# EAGLE schematic Battery Charger (EAGLE 9.6.2)

## Sheet 1 of 5
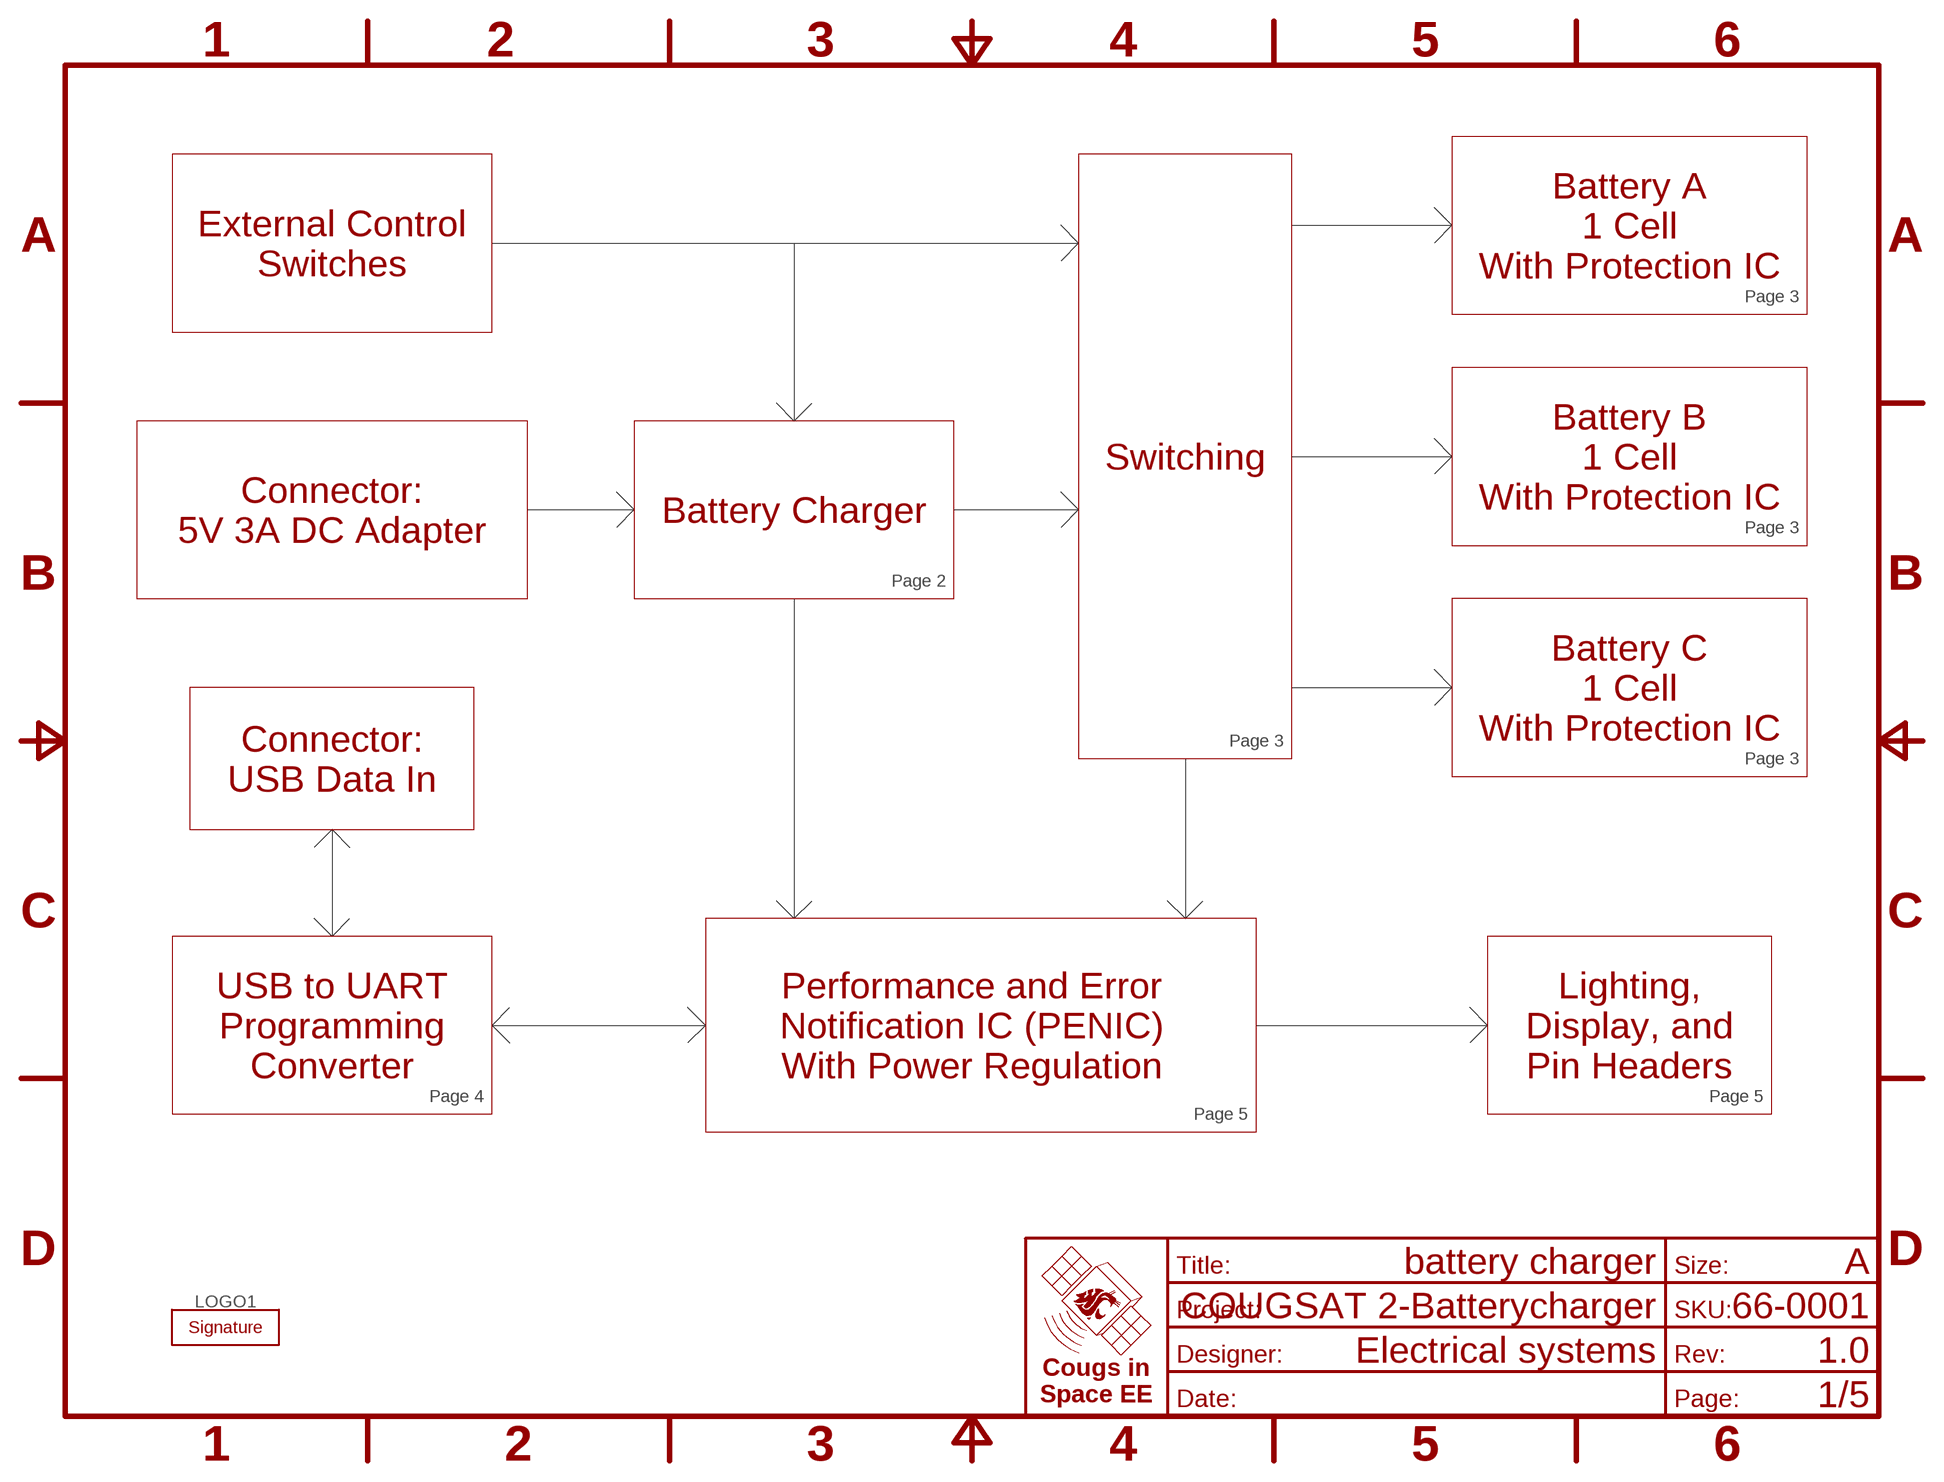
[diagram p0: schematic, sheet 1]
FRAME1 (FRAME-A): DESIGNER: Electrical systems; PART_NUMBER: 66-0001; PROJECT: COUGSAT 2-Batterycharger; REV: 1.0; TITLE: battery charger

### Parts
LOGO1  SIGNATUREZACHARY  [SIGN-ZACHARY]

### Notes on the sheet
- Battery A
  1 Cell
  With Protection IC
- External Control
  Switches
- Page 3
- Switching
- Battery B
  1 Cell
  With Protection IC
- Connector:
  5V 3A DC Adapter
- Battery Charger
- Page 3
- Page 2
- Battery C
  1 Cell
  With Protection IC
- Page 3
- Connector:
  USB Data In
- Page 3
- USB to UART
  Programming
  Converter
- Performance and Error
  Notification IC (PENIC)
  With Power Regulation
- Lighting,
  Display, and
  Pin Headers
- Page 4 | Page 5
- Page 5

## Sheet 2 of 5
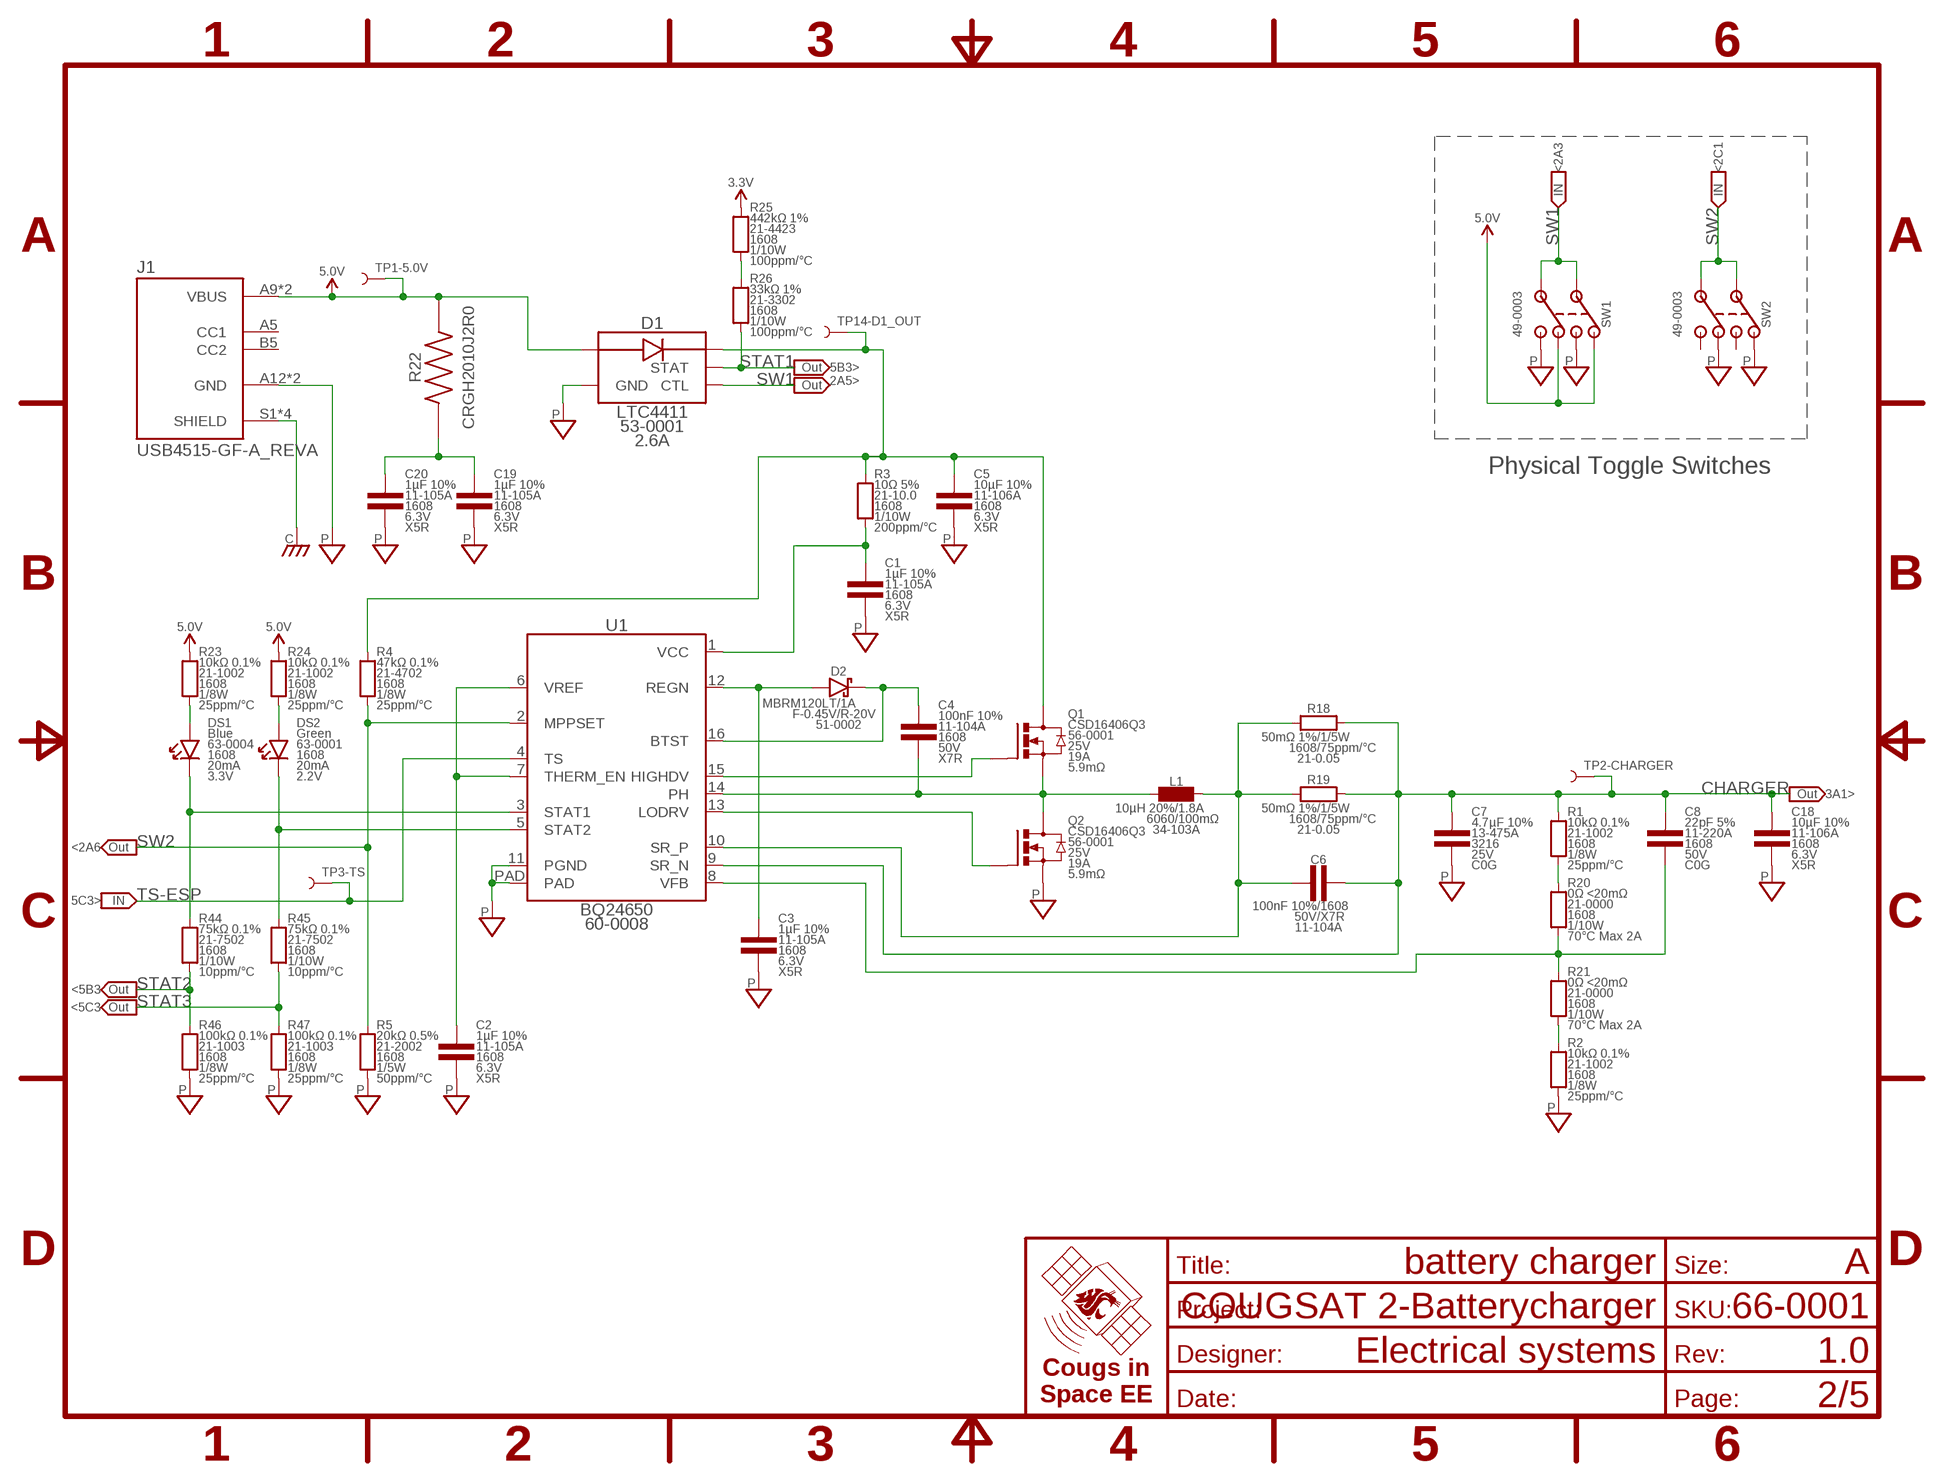
[diagram p1: schematic, sheet 2]
FRAME2 (FRAME-A): DESIGNER: Electrical systems; PART_NUMBER: 66-0001; PROJECT: COUGSAT 2-Batterycharger; REV: 1.0; TITLE: battery charger

### Parts
C1  1µF 10%  CAP-V-1UF-1608  [1608]
C2  1µF 10%  CAP-V-1UF-1608  [1608]
C3  1µF 10%  CAP-V-1UF-1608  [1608]
C4  100nF 10%  CAP-V-100NF-1608  [1608]
C5  10µF 10%  CAP-V-10UF-1608  [1608]
C6  100nF 10%  CAP-H-100NF-1608  [1608]
C7  4.7µF 10%  CAP-V-4.7UF-3216  [3216]
C8  22pF 5%  CAP-V-22PF-1608  [1608]
C18  10µF 10%  CAP-V-10UF-1608  [1608]
C19  1µF 10%  CAP-V-1UF-1608  [1608]
C20  1µF 10%  CAP-V-1UF-1608  [1608]
D1  LTC4411  [SOT23-5]
D2  MBRM120LT  DIODE-SCHOTTKY-H-POWERMITE  [POWERMITE]
DS1  Blue  LED-V-BLU-1608  [1608-POL]
DS2  Green  LED-V-GRN-1608  [1608-POL]
J1  USB4515-GF-A_REVA  [GCT_USB4515-GF-A_REVA]
L1  10µH 20%  INDUCTOR-H-10UH-6060  [6060]
Q1  CSD16406Q3  MOSFET-N-SON-3333  [SON-3333]
Q2  CSD16406Q3  MOSFET-N-SON-3333  [SON-3333]
R1  10kΩ 0.1%  RES-V-10K-1608  [1608]
R2  10kΩ 0.1%  RES-V-10K-1608  [1608]
R3  10Ω 5%  RES-V-10R-1608  [1608]
R4  47kΩ 0.1%  RES-V-47K-1608  [1608]
R5  20kΩ 0.5%  RES-V-20K-1608  [1608]
R18  50mΩ 1%  RES-H-0.05R-1608  [1608]
R19  50mΩ 1%  RES-H-0.05R-1608  [1608]
R20  0Ω <20mΩ  RES-V-0-1608  [1608]
R21  0Ω <20mΩ  RES-V-0-1608  [1608]
R22  CRGH2010J2R0  [RESC5025X65N]
R23  10kΩ 0.1%  RES-V-10K-1608  [1608]
R24  10kΩ 0.1%  RES-V-10K-1608  [1608]
R25  442kΩ 1%  RES-V-442K-1608  [1608]
R26  33kΩ 1%  RES-V-33K-1608  [1608]
R44  75kΩ 0.1%  RES-V-75K-1608  [1608]
R45  75kΩ 0.1%  RES-V-75K-1608  [1608]
R46  100kΩ 0.1%  RES-V-100K-1608  [1608]
R47  100kΩ 0.1%  RES-V-100K-1608  [1608]
SW1  SWITCH-DPDT-100DP1T1B1M2QE  [100DP1T1B1M2QE]
SW2  SWITCH-DPDT-100DP1T1B1M2QE  [100DP1T1B1M2QE]
TP1-5.0V  TEST_POINT-SMD-C-1.25  [SMD-C-1.25]
TP2-CHARGER  TEST_POINT-SMD-C-1.25  [SMD-C-1.25]
TP3-TS  TEST_POINT-SMD-C-1.25  [SMD-C-1.25]
TP14-D1_OUT  TEST_POINT-SMD-C-1.25  [SMD-C-1.25]
U1  BQ24650  [QFN-16-3535]

### Nets
3.3V: R25.2 ; also sheet 3,5
5.0V: D1.1(IN) J1.A9(VBUS) J1.B9(VBUS) R22.2 R23.2 R24.2 SW1.1-A SW1.1-B TP1-5.0V.1 ; also sheet 3,5
BQ24650_BTST: C4.1 D2.C U1.16(BTST)
BQ24650_HIGHDV: Q1.4(G) U1.15(HIGHDV)
BQ24650_LODRV: Q2.4(G) U1.13(LODRV)
BQ24650_PH: C4.2 L1.1 Q1.1(S) Q1.2(S) Q1.3(S) Q2.5(D) Q2.6(D) Q2.7(D) Q2.8(D) Q2.PAD(D) U1.14(PH)
BQ24650_REGN: C3.1 D2.A U1.12(REGN)
BQ24650_SR_P: C6.1 L1.2 R18.1 R19.1 U1.10(SR_P)
BQ24650_STAT1: DS1.C R44.2 U1.3(STAT1)
BQ24650_STAT2: DS2.C R45.2 U1.5(STAT2)
BQ24650_VCC: C1.1 R3.1 U1.1(VCC)
BQ24650_VFB: C8.2 R20.1 R21.2 U1.8(VFB)
BQ24650_VREF: C2.1 U1.6(VREF) U1.7(THERM_EN)
CHARGER: C6.2 C7.1 C8.1 C18.1 R1.2 R18.2 R19.2 TP2-CHARGER.1 U1.9(SR_N) ; also sheet 3
CHASSIS: J1.S1(SHIELD) J1.S2(SHIELD) J1.S3(SHIELD) J1.S4(SHIELD) ; also sheet 4
D1_OUT: C5.1 D1.5(OUT) Q1.5(D) Q1.6(D) Q1.7(D) Q1.8(D) Q1.PAD(D) R3.2 R4.2 TP14-D1_OUT.1
N$11: DS1.A R23.1
N$15: R1.1 R20.2
N$32: R2.2 R21.1
N$33: DS2.A R24.1
N$34: C19.1 C20.1 R22.1
N$35: R25.1 R26.2
PGND: C1.2 C2.2 C3.2 C5.2 C7.2 C18.2 C19.2 C20.2 D1.2(GND) J1.A12(GND) J1.B12(GND) Q2.1(S) Q2.2(S) Q2.3(S) R2.1 R5.1 R46.1 R47.1 SW1.2-A SW1.2-B SW2.1-A SW2.1-B U1.11(PGND) U1.PAD ; also sheet 3,4,5
STAT1: D1.4(STAT) R26.1 ; also sheet 5
STAT2: R44.1 R46.2 ; also sheet 5
STAT3: R45.1 R47.2 ; also sheet 5
SW1: D1.3(CTL) SW1.COM-A SW1.COM-B
SW2: R4.1 R5.2 SW2.COM-A SW2.COM-B U1.2(MPPSET)
TS-ESP: TP3-TS.1 U1.4(TS) ; also sheet 5
Unconnected: J1.A5(CC1) J1.B5(CC2) SW2.2-A SW2.2-B

### Notes on the sheet
- <2A3 | <2C1
- SW1 | SW2
- STAT1 | 5B3>
- SW1 | 2A5>
- Physical Toggle Switches
- 3A1>
- <2A6 | SW2
- 5C3>
- <5B3 | STAT2
- <5C3 | STAT3

## Sheet 3 of 5
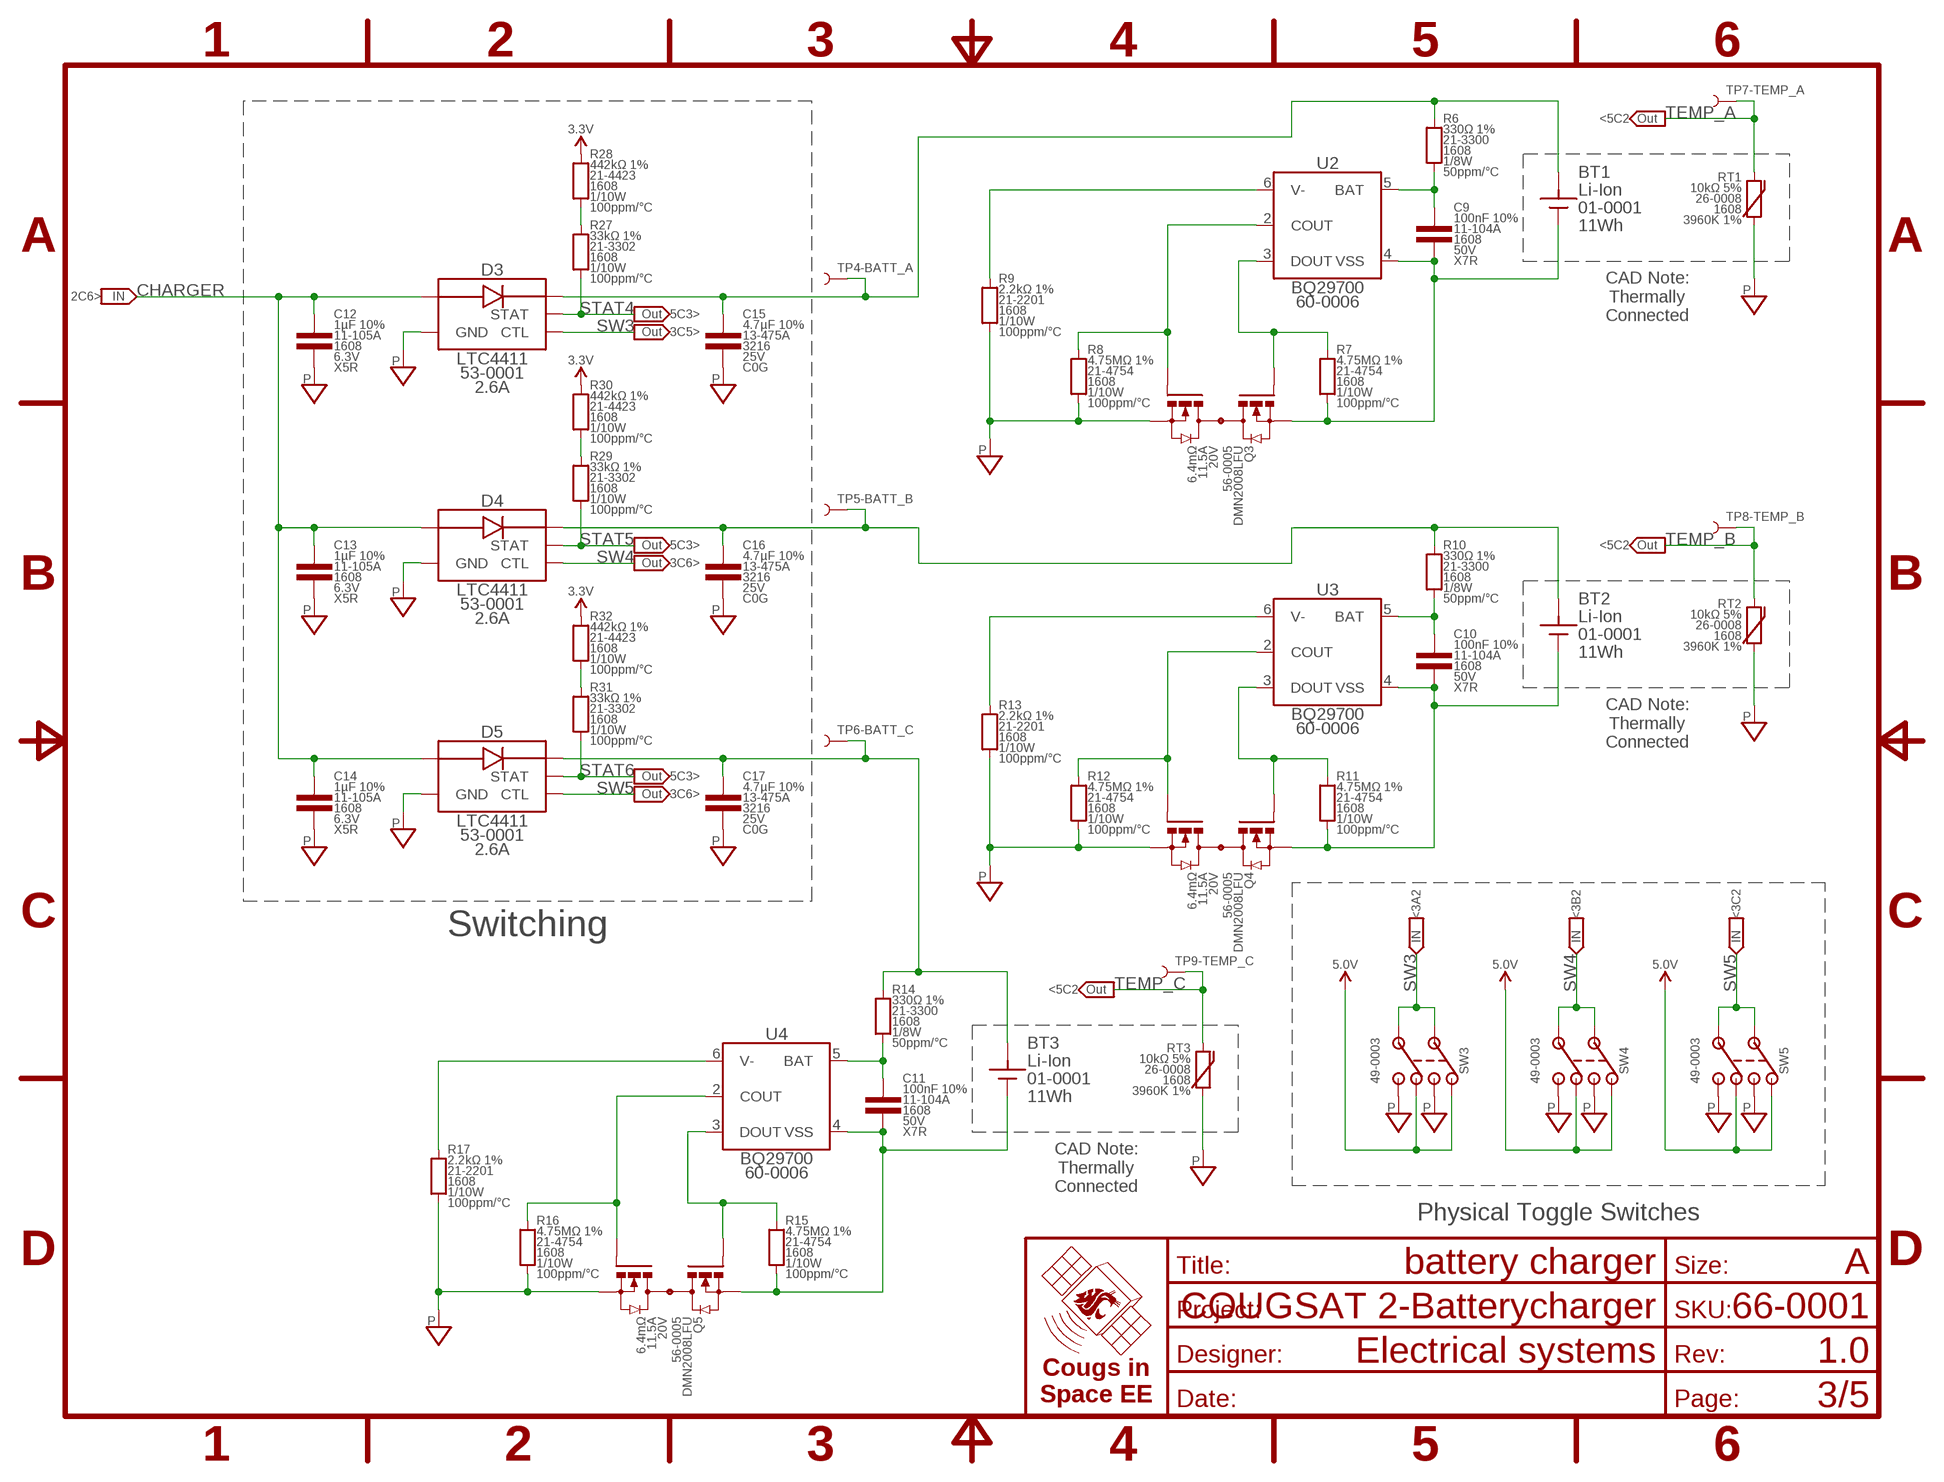
[diagram p2: schematic, sheet 3]
FRAME3 (FRAME-A): DESIGNER: Electrical systems; PART_NUMBER: 66-0001; PROJECT: COUGSAT 2-Batterycharger; REV: 1.0; TITLE: battery charger

### Parts
BT1  Li-Ion  BATTERY-18650HG2  [18650-SOLDERED]
BT2  Li-Ion  BATTERY-18650HG2  [18650-SOLDERED]
BT3  Li-Ion  BATTERY-18650HG2  [18650-SOLDERED]
C9  100nF 10%  CAP-V-100NF-1608  [1608]
C10  100nF 10%  CAP-V-100NF-1608  [1608]
C11  100nF 10%  CAP-V-100NF-1608  [1608]
C12  1µF 10%  CAP-V-1UF-1608  [1608]
C13  1µF 10%  CAP-V-1UF-1608  [1608]
C14  1µF 10%  CAP-V-1UF-1608  [1608]
C15  4.7µF 10%  CAP-V-4.7UF-3216  [3216]
C16  4.7µF 10%  CAP-V-4.7UF-3216  [3216]
C17  4.7µF 10%  CAP-V-4.7UF-3216  [3216]
D3  LTC4411  [SOT23-5]
D4  LTC4411  [SOT23-5]
D5  LTC4411  [SOT23-5]
Q3  DMN2008LFU  MOSFET_DUAL_COM_D-N-DMN2008LFU-UDFN-6-B  [UDFN-6-B]
Q4  DMN2008LFU  MOSFET_DUAL_COM_D-N-DMN2008LFU-UDFN-6-B  [UDFN-6-B]
Q5  DMN2008LFU  MOSFET_DUAL_COM_D-N-DMN2008LFU-UDFN-6-B  [UDFN-6-B]
R6  330Ω 1%  RES-V-330R-1608  [1608]
R7  4.75MΩ 1%  RES-V-4.75M-1608  [1608]
R8  4.75MΩ 1%  RES-V-4.75M-1608  [1608]
R9  2.2kΩ 1%  RES-V-2.2K-1608  [1608]
R10  330Ω 1%  RES-V-330R-1608  [1608]
R11  4.75MΩ 1%  RES-V-4.75M-1608  [1608]
R12  4.75MΩ 1%  RES-V-4.75M-1608  [1608]
R13  2.2kΩ 1%  RES-V-2.2K-1608  [1608]
R14  330Ω 1%  RES-V-330R-1608  [1608]
R15  4.75MΩ 1%  RES-V-4.75M-1608  [1608]
R16  4.75MΩ 1%  RES-V-4.75M-1608  [1608]
R17  2.2kΩ 1%  RES-V-2.2K-1608  [1608]
R27  33kΩ 1%  RES-V-33K-1608  [1608]
R28  442kΩ 1%  RES-V-442K-1608  [1608]
R29  33kΩ 1%  RES-V-33K-1608  [1608]
R30  442kΩ 1%  RES-V-442K-1608  [1608]
R31  33kΩ 1%  RES-V-33K-1608  [1608]
R32  442kΩ 1%  RES-V-442K-1608  [1608]
RT1  10kΩ 5%  THERMISTOR-V-10K-1608  [1608]
RT2  10kΩ 5%  THERMISTOR-V-10K-1608  [1608]
RT3  10kΩ 5%  THERMISTOR-V-10K-1608  [1608]
SW3  SWITCH-DPDT-100DP1T1B1M2QE  [100DP1T1B1M2QE]
SW4  SWITCH-DPDT-100DP1T1B1M2QE  [100DP1T1B1M2QE]
SW5  SWITCH-DPDT-100DP1T1B1M2QE  [100DP1T1B1M2QE]
TP4-BATT_A  TEST_POINT-SMD-C-1.25  [SMD-C-1.25]
TP5-BATT_B  TEST_POINT-SMD-C-1.25  [SMD-C-1.25]
TP6-BATT_C  TEST_POINT-SMD-C-1.25  [SMD-C-1.25]
TP7-TEMP_A  TEST_POINT-SMD-C-1.25  [SMD-C-1.25]
TP8-TEMP_B  TEST_POINT-SMD-C-1.25  [SMD-C-1.25]
TP9-TEMP_C  TEST_POINT-SMD-C-1.25  [SMD-C-1.25]
U2  BQ29700  [WSON-6]
U3  BQ29700  [WSON-6]
U4  BQ29700  [WSON-6]

### Nets
3.3V: R28.2 R30.2 R32.2 ; also sheet 2,5
5.0V: SW3.1-A SW3.1-B SW4.1-A SW4.1-B SW5.1-A SW5.1-B ; also sheet 2,5
BQ297001_BAT: C9.1 R6.1 U2.5(BAT)
BQ297001_COUT: Q3.3(G1) R8.2 U2.2(COUT)
BQ297001_DOUT: Q3.4(G2) R7.2 U2.3(DOUT)
BQ297001_V-: R9.2 U2.6(V-)
BQ297001_VSS: BT1.A C9.2 Q3.6(S2) R7.1 U2.4(VSS)
BQ297002_BAT: C10.1 R10.1 U3.5(BAT)
BQ297002_COUT: Q4.3(G1) R12.2 U3.2(COUT)
BQ297002_DOUT: Q4.4(G2) R11.2 U3.3(DOUT)
BQ297002_V-: R13.2 U3.6(V-)
BQ297002_VSS: BT2.A C10.2 Q4.6(S2) R11.1 U3.4(VSS)
BQ297003_BAT: C11.1 R14.1 U4.5(BAT)
BQ297003_COUT: Q5.3(G1) R16.2 U4.2(COUT)
BQ297003_DOUT: Q5.4(G2) R15.2 U4.3(DOUT)
BQ297003_V-: R17.2 U4.6(V-)
BQ297003_VSS: BT3.A C11.2 Q5.6(S2) R15.1 U4.4(VSS)
CHARGER: C12.1 C13.1 C14.1 D3.1(IN) D4.1(IN) D5.1(IN) ; also sheet 2
D3_OUT: BT1.C C15.1 D3.5(OUT) R6.2 TP4-BATT_A.1
D4_OUT: BT2.C C16.1 D4.5(OUT) R10.2 TP5-BATT_B.1
D5_OUT: BT3.C C17.1 D5.5(OUT) R14.2 TP6-BATT_C.1
N$36: R27.2 R28.1
N$37: R29.2 R30.1
N$38: R31.2 R32.1
PGND: C12.2 C13.2 C14.2 C15.2 C16.2 C17.2 D3.2(GND) D4.2(GND) D5.2(GND) Q3.1(S1) Q4.1(S1) Q5.1(S1) R8.1 R9.1 R12.1 R13.1 R16.1 R17.1 RT1.1 RT2.1 RT3.1 SW3.2-A SW3.2-B SW4.2-A SW4.2-B SW5.2-A SW5.2-B ; also sheet 2,4,5
STAT4: D3.4(STAT) R27.1 ; also sheet 5
STAT5: D4.4(STAT) R29.1 ; also sheet 5
STAT6: D5.4(STAT) R31.1 ; also sheet 5
SW3: D3.3(CTL) SW3.COM-A SW3.COM-B
SW4: D4.3(CTL) SW4.COM-A SW4.COM-B
SW5: D5.3(CTL) SW5.COM-A SW5.COM-B
TEMP_A: RT1.2 TP7-TEMP_A.1 ; also sheet 5
TEMP_B: RT2.2 TP8-TEMP_B.1 ; also sheet 5
TEMP_C: RT3.2 TP9-TEMP_C.1 ; also sheet 5
Unconnected: Q3.PAD(D) Q4.PAD(D) Q5.PAD(D)

### Notes on the sheet
- <5C2
- 2C6>
- CAD Note:
  Thermally
  Connected
- STAT4 | 5C3>
- SW3 | 3C5>
- STAT5 | 5C3> | <5C2
- SW4 | 3C6>
- CAD Note:
  Thermally
  Connected
- STAT6 | 5C3>
- SW5 | 3C6>
- <3A2 | <3B2 | <3C2
- Switching
- SW3 | SW4 | SW5
- <5C2
- CAD Note:
  Thermally
  Connected
- Physical Toggle Switches

## Sheet 4 of 5
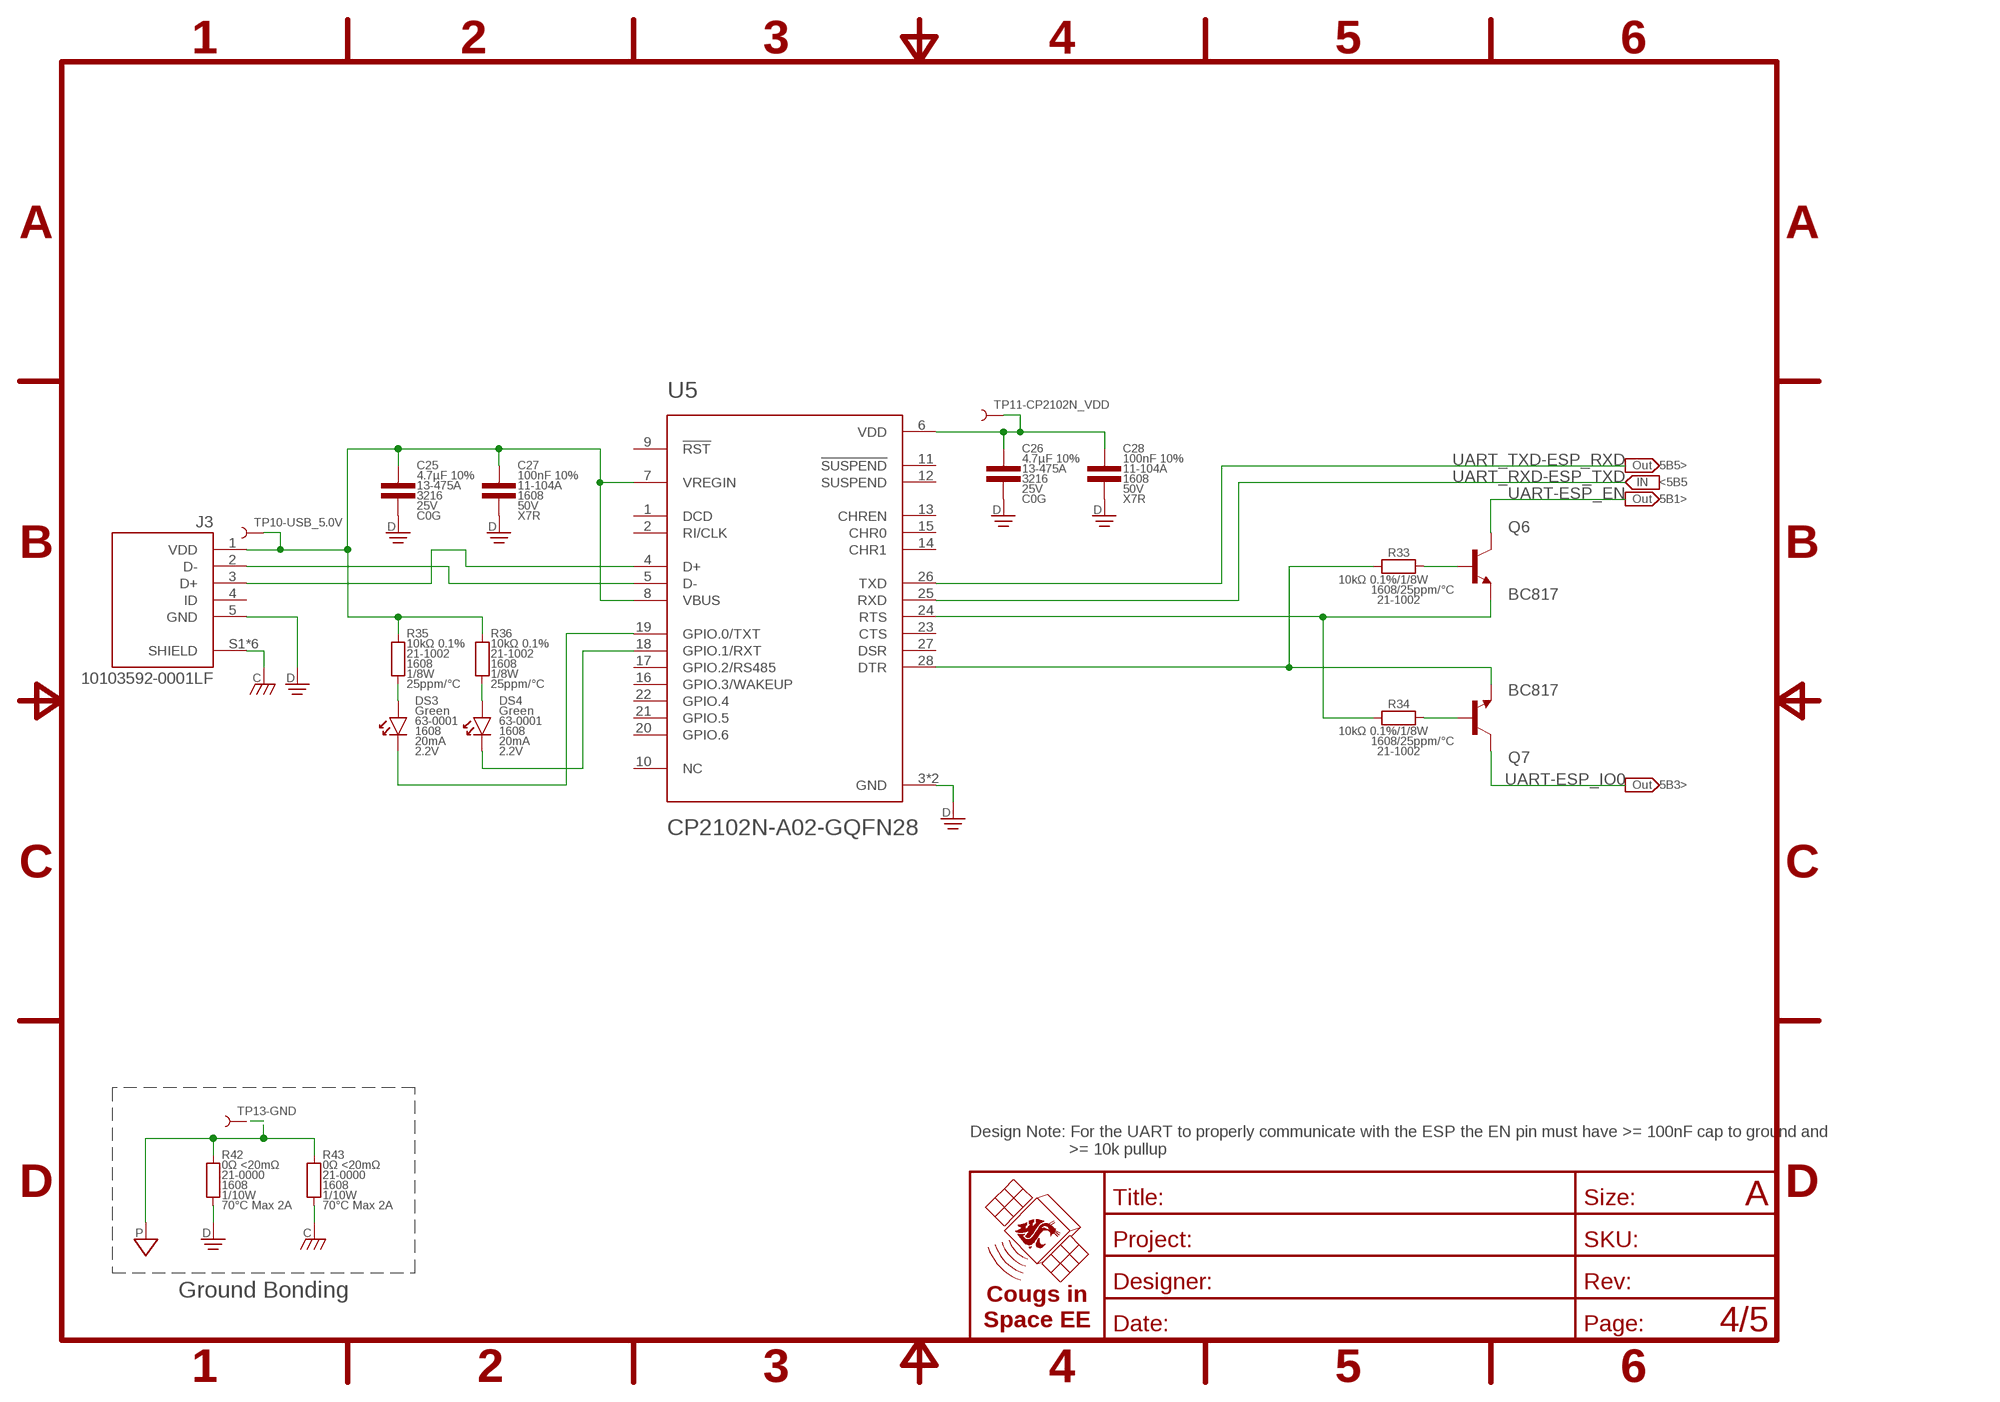
[diagram p3: schematic, sheet 4]

### Parts
C25  4.7µF 10%  CAP-V-4.7UF-3216  [3216]
C26  4.7µF 10%  CAP-V-4.7UF-3216  [3216]
C27  100nF 10%  CAP-V-100NF-1608  [1608]
C28  100nF 10%  CAP-V-100NF-1608  [1608]
DS3  Green  LED-V-GRN-1608  [1608-POL]
DS4  Green  LED-V-GRN-1608  [1608-POL]
J3  10103592-0001LF  [AMPHENOL_10103592-0001LF]
Q6  BC817  [SOT95P230X110-3N]
Q7  BC817  [SOT95P230X110-3N]
R33  10kΩ 0.1%  RES-H-10K-1608  [1608]
R34  10kΩ 0.1%  RES-H-10K-1608  [1608]
R35  10kΩ 0.1%  RES-V-10K-1608  [1608]
R36  10kΩ 0.1%  RES-V-10K-1608  [1608]
R42  0Ω <20mΩ  RES-V-0-1608  [1608]
R43  0Ω <20mΩ  RES-V-0-1608  [1608]
TP10-USB_5.0V  TEST_POINT-SMD-C-1.25  [SMD-C-1.25]
TP11-CP2102N_VDD  TEST_POINT-SMD-C-1.25  [SMD-C-1.25]
TP13-GND  TEST_POINT-SMD-C-1.25  [SMD-C-1.25]
U5  CP2102N-A02-GQFN28  [QFN50P500X500X80-29N]

### Nets
CHASSIS: J3.S1(SHIELD) J3.S2(SHIELD) J3.S3(SHIELD) J3.S4(SHIELD) J3.S5(SHIELD) J3.S6(SHIELD) R43.1 ; also sheet 2
CP2102N_DTR: Q7.2(E) R33.1 U5.28(DTR)
CP2102N_RTS: Q6.2(E) R34.1 U5.24(RTS)
CP2102N_RXT: DS4.C U5.18(GPIO.1/RXT)
CP2102N_TXT: DS3.C U5.19(GPIO.0/TXT)
CP2102N_VDD: C26.1 C28.1 TP11-CP2102N_VDD.1 U5.6(VDD)
D+: J3.3(D+) U5.4(D+)
D-: J3.2(D-) U5.5(D-)
DGND: C25.2 C26.2 C27.2 C28.2 J3.5(GND) R42.1 U5.3(GND) U5.29(GND)
N$48: Q7.1(B) R34.2
N$49: Q6.1(B) R33.2
N$50: DS3.A R35.1
N$51: DS4.A R36.1
PGND: R42.2 R43.2 TP13-GND.1 ; also sheet 2,3,5
UART-ESP_EN: Q6.3(C) ; also sheet 5
UART-ESP_IO0: Q7.3(C) ; also sheet 5
UART_RXD-ESP_TXD: U5.25(RXD) ; also sheet 5
UART_TXD-ESP_RXD: U5.26(TXD) ; also sheet 5
USB_VDD: C25.1 C27.1 J3.1(VDD) R35.2 R36.2 TP10-USB_5.0V.1 U5.7(VREGIN) U5.8(VBUS)
Unconnected: J3.4(ID) U5.1(DCD) U5.2(RI/CLK) U5.9(!RST) U5.10(NC) U5.11(!SUSPEND) U5.12(SUSPEND) U5.13(CHREN) U5.14(CHR1) U5.15(CHR0) U5.16(GPIO.3/WAKEUP) U5.17(GPIO.2/RS485) U5.20(GPIO.6) U5.21(GPIO.5) U5.22(GPIO.4) U5.23(CTS) U5.27(DSR)

### Notes on the sheet
- 5B5>
- <5B5
- 5B1>
- 5B3>
- Design Note: For the UART to properly communicate with the ESP the EN pin must have >= 100nF cap to ground and
                        >= 10k pullup
- Ground Bonding

## Sheet 5 of 5
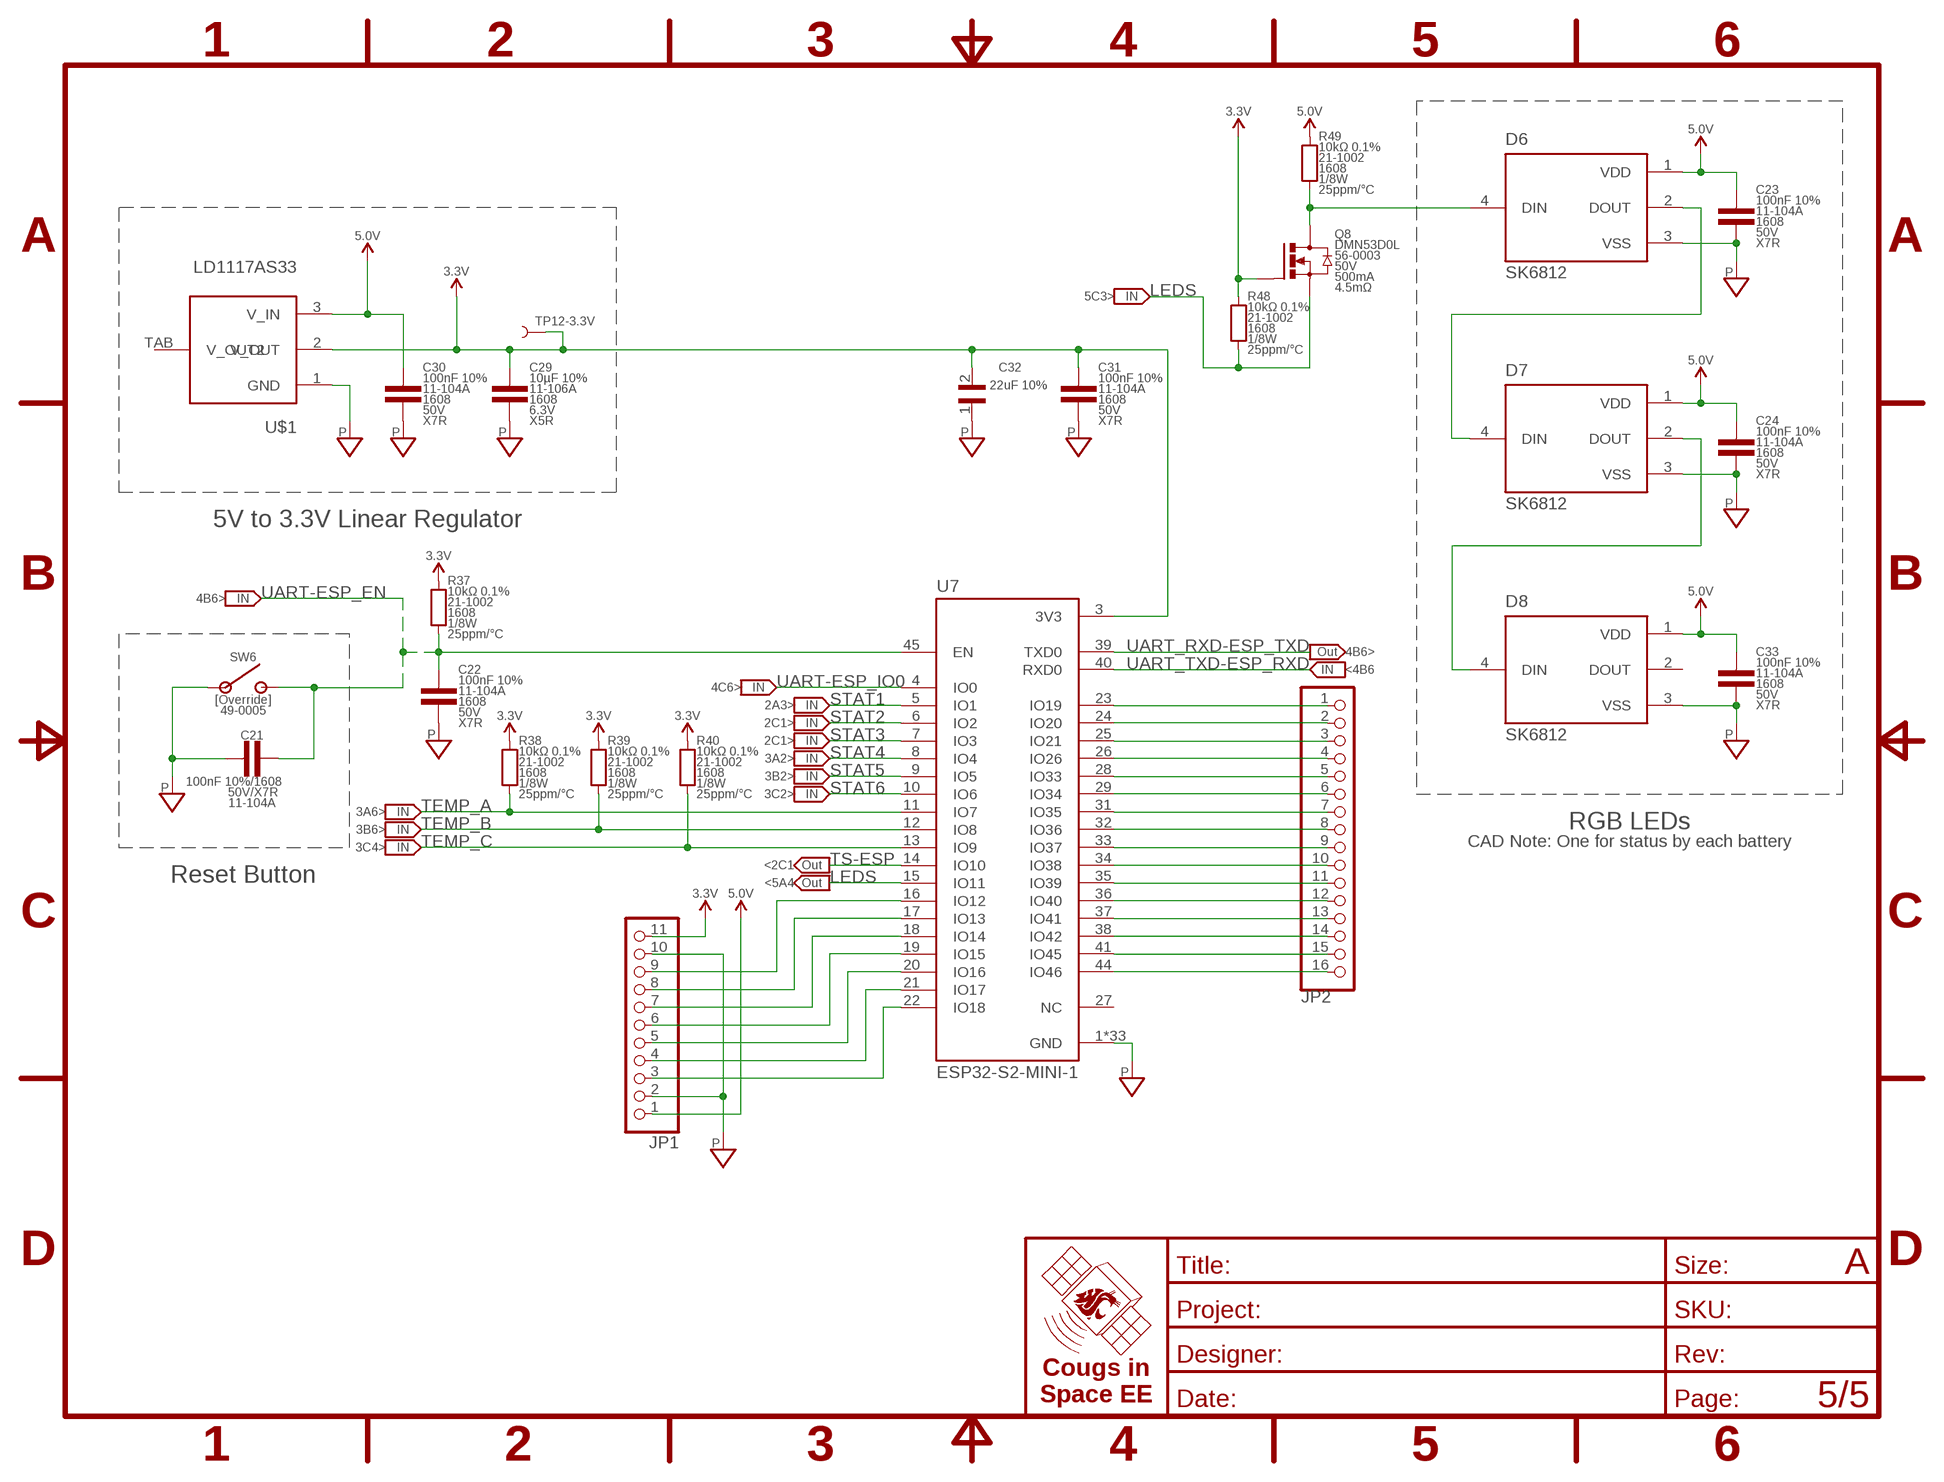
[diagram p4: schematic, sheet 5]

### Parts
C21  100nF 10%  CAP-H-100NF-1608  [1608]
C22  100nF 10%  CAP-V-100NF-1608  [1608]
C23  100nF 10%  CAP-V-100NF-1608  [1608]
C24  100nF 10%  CAP-V-100NF-1608  [1608]
C29  10µF 10%  CAP-V-10UF-1608  [1608]
C30  100nF 10%  CAP-V-100NF-1608  [1608]
C31  100nF 10%  CAP-V-100NF-1608  [1608]
C32  C1206C226K8RACTU  [CAPC3216X110N]
C33  100nF 10%  CAP-V-100NF-1608  [1608]
D6  SK6812  [LED_SK6812]
D7  SK6812  [LED_SK6812]
D8  SK6812  [LED_SK6812]
JP1  PINHD-1X11  [1X11]
JP2  PINHD-1X16  [1X16]
Q8  DMN53D0L  MOSFET-N-SOT23-3  [SOT23-3]
R37  10kΩ 0.1%  RES-V-10K-1608  [1608]
R38  10kΩ 0.1%  RES-V-10K-1608  [1608]
R39  10kΩ 0.1%  RES-V-10K-1608  [1608]
R40  10kΩ 0.1%  RES-V-10K-1608  [1608]
R48  10kΩ 0.1%  RES-V-10K-1608  [1608]
R49  10kΩ 0.1%  RES-V-10K-1608  [1608]
SW6  [Override]  SWITCH-SPST-NO-B3F-1050-THT-6060  [THT-6060]
TP12-3.3V  TEST_POINT-SMD-C-1.25  [SMD-C-1.25]
U7  ESP32-S2-MINI-1  [XCVR_ESP32-S2-MINI-1]
U$1  LD1117AS33  [SOT223]

### Nets
3.3V: C29.1 C31.1 C32.2 JP1.11 Q8.1(G) R37.2 R38.2 R39.2 R40.2 R48.2 TP12-3.3V.1 U7.3(3V3) U$1.2(V_OUT) ; also sheet 2,3
5.0V: C23.1 C24.1 C30.1 C33.1 D6.1(VDD) D7.1(VDD) D8.1(VDD) JP1.1 R49.2 U$1.3(V_IN) ; also sheet 2,3
ESP32_IO12: JP1.9 U7.16(IO12)
ESP32_IO13: JP1.8 U7.17(IO13)
ESP32_IO14: JP1.7 U7.18(IO14)
ESP32_IO15: JP1.6 U7.19(IO15)
ESP32_IO16: JP1.5 U7.20(IO16)
ESP32_IO17: JP1.4 U7.21(IO17)
ESP32_IO18: JP1.3 U7.22(IO18)
ESP32_IO19: JP2.1 U7.23(IO19)
ESP32_IO20: JP2.2 U7.24(IO20)
ESP32_IO21: JP2.3 U7.25(IO21)
ESP32_IO26: JP2.4 U7.26(IO26)
ESP32_IO33: JP2.5 U7.28(IO33)
ESP32_IO34: JP2.6 U7.29(IO34)
ESP32_IO35: JP2.7 U7.31(IO35)
ESP32_IO36: JP2.8 U7.32(IO36)
ESP32_IO37: JP2.9 U7.33(IO37)
ESP32_IO38: JP2.10 U7.34(IO38)
ESP32_IO39: JP2.11 U7.35(IO39)
ESP32_IO40: JP2.12 U7.36(IO40)
ESP32_IO41: JP2.13 U7.37(IO41)
ESP32_IO42: JP2.14 U7.38(IO42)
ESP32_IO45: JP2.15 U7.41(IO45)
ESP32_IO46: JP2.16 U7.44(IO46)
LED1_DIN: D6.4(DIN) Q8.3(D) R49.1
LED2_DIN: D6.2(DOUT) D7.4(DIN)
LED3_DIN: D7.2(DOUT) D8.4(DIN)
LEDS: Q8.2(S) R48.1 U7.15(IO11)
PGND: C21.1 C22.2 C23.2 C24.2 C29.2 C30.2 C31.2 C32.1 C33.2 D6.3(VSS) D7.3(VSS) D8.3(VSS) JP1.2 JP1.10 SW6.1(COM) SW6.2(COM) U7.1(GND) U7.2(GND) U7.30(GND) U7.42(GND) U7.43(GND) U7.46(GND) U7.47(GND) U7.48(GND) U7.49(GND) U7.50(GND) U7.51(GND) U7.52(GND) U7.53(GND) U7.54(GND) U7.55(GND) U7.56(GND) U7.57(GND) U7.58(GND) U7.59(GND) U7.60(GND) U7.61(GND) U7.61_1(GND) U7.61_2(GND) U7.61_3(GND) U7.61_4(GND) U7.61_5(GND) U7.61_6(GND) U7.61_7(GND) U7.61_8(GND) U7.62(GND) U7.63(GND) U7.64(GND) U7.65(GND) U$1.1(GND) ; also sheet 2,3,4
STAT1: U7.5(IO1) ; also sheet 2
STAT2: U7.6(IO2) ; also sheet 2
STAT3: U7.7(IO3) ; also sheet 2
STAT4: U7.8(IO4) ; also sheet 3
STAT5: U7.9(IO5) ; also sheet 3
STAT6: U7.10(IO6) ; also sheet 3
TEMP_A: R38.1 U7.11(IO7) ; also sheet 3
TEMP_B: R39.1 U7.12(IO8) ; also sheet 3
TEMP_C: R40.1 U7.13(IO9) ; also sheet 3
TS-ESP: U7.14(IO10) ; also sheet 2
UART-ESP_EN: C21.2 C22.1 R37.1 SW6.3(NO) SW6.4(NO) U7.45(EN) ; also sheet 4
UART-ESP_IO0: U7.4(IO0) ; also sheet 4
UART_RXD-ESP_TXD: U7.39(TXD0) ; also sheet 4
UART_TXD-ESP_RXD: U7.40(RXD0) ; also sheet 4
Unconnected: D8.2(DOUT) U7.27(NC) U$1.TAB(V_OUT2)

### Notes on the sheet
- 5C3>
- 22uF 10%
- 5V to 3.3V Linear Regulator
- 4B6>
- 4B6>
- <4B6
- 4C6>
- 2A3>
- 2C1>
- 2C1>
- 3A2>
- 3B2>
- 3C2>
- 3A6>
- 3B6> | RGB LEDs
- 3C4> | CAD Note: One for status by each battery
- <2C1
- Reset Button | <5A4

## Library data of the parts
BT1-BT3 = CougsInSpace-Energy:BATTERY-?*: Battery - 1 Cell 18650HG2 <https://github.com/CougsInSpace/Resources/blob/master/SupplierDocuments/LG/Battery%2018650HG2.pdf>; CAPACITY: 11Wh; SKU: 01-0001
C1-C3 C12-C14 C19 C20 = CougsInSpace-Capacitors:CAP-V: Capacitor - Vertical Orientation; PACKAGE: 1608; SKU: 11-105A; TEMP: X5R; VOLTAGE: 6.3V
C4 C9-C11 C22-C24 C27 C28 C30 C31 C33 = CougsInSpace-Capacitors:CAP-V: Capacitor - Vertical Orientation; PACKAGE: 1608; SKU: 11-104A; TEMP: X7R; VOLTAGE: 50V
C5 C18 C29 = CougsInSpace-Capacitors:CAP-V: Capacitor - Vertical Orientation; PACKAGE: 1608; SKU: 11-106A; TEMP: X5R; VOLTAGE: 6.3V
C6 C21 = CougsInSpace-Capacitors:CAP-H: Capacitor - Horizontal Orientation; PACKAGE: 1608; SKU: 11-104A; TEMP: X7R; VOLTAGE: 50V
C7 C15-C17 C25 C26 = CougsInSpace-Capacitors:CAP-V: Capacitor - Vertical Orientation; PACKAGE: 3216; SKU: 13-475A; TEMP: C0G; VOLTAGE: 25V
C8 = CougsInSpace-Capacitors:CAP-V: Capacitor - Vertical Orientation; PACKAGE: 1608; SKU: 11-220A; TEMP: C0G; VOLTAGE: 50V
C32 = C1206C226K8RACTU:C1206C226K8RACTU: CAP, MLCC, X7R, 22UF, 10V, 1206 Check availability <https://pricing.snapeda.com/parts/C1206C226K8RACTU/KEMET/view-part?ref=eda>; AVAILABILITY: In Stock; DESCRIPTION: 22 µF ±10% 10V Ceramic Capacitor X7R 1206 (3216 Metric); MF: KEMET; MP: C1206C226K8RACTU; PACKAGE: 1206 KEMET; PRICE: None; PURCHASE-URL: https://pricing.snapeda.com/search/part/C1206C226K8RACTU/?ref=eda
D1 D3-D5 = CougsInSpace-DiscreteSemi:LTC4411: LTC4411 Ideal diode (transistor acting as a diode); CURRENT: 2.6A; SKU: 53-0001
D2 = CougsInSpace-DiscreteSemi:DIODE-SCHOTTKY-H: Diode Schottky Horizontal; CURRENT: 1A; SKU: 51-0002; VF: F-0.45V; VR: R-20V
D6-D8 = SK6812:SK6812: SMD 5050 Full color RGB LED data transmission frequency up to 800Kbps, with 30 fps refresh rate, 5.00x5.00 mm Check availability <https://pricing.snapeda.com/parts/SK6812/Normand%20Electronics/view-part?ref=eda>; AVAILABILITY: Not in stock; DESCRIPTION: 5.4x5.0x1.6 mm 0.2W Intelligent external control surface mount SMD LED (MSL:5a); MF: Normand Electronics; MP: SK6812; PACKAGE: None; PRICE: None
DS1 = CougsInSpace-LEDs:LED-V: LED Vertical; CURRENT: 20mA; PACKAGE: 1608; SKU: 63-0004; VF: 3.3V
DS2-DS4 = CougsInSpace-LEDs:LED-V: LED Vertical; CURRENT: 20mA; PACKAGE: 1608; SKU: 63-0001; VF: 2.2V
J1 = USB4515-GF-A_REVA:USB4515-GF-A_REVA: Check availability <https://pricing.snapeda.com/parts/USB4515-GF-A/Global%20Connector%20Technology/view-part?ref=eda>; AVAILABILITY: In Stock; DESCRIPTION: Type C USB Charging Connector; MF: Global Connector Technology; MP: USB4515-GF-A; PACKAGE: None; PRICE: None; PURCHASE-URL: https://pricing.snapeda.com/search/part/USB4515-GF-A/?ref=eda
J3 = 10103592-0001LF:10103592-0001LF: Check availability <https://pricing.snapeda.com/parts/10103592-0001LF/AMPHENOL%20ICC%20/%20FCI/view-part?ref=eda>; AVAILABILITY: In Stock; DESCRIPTION: Micro USB 2.0, Input Output Connectors, B TYPE REVERSE; MF: AMPHENOL ICC / FCI; MP: 10103592-0001LF; PACKAGE: None; PRICE: None; PURCHASE-URL: https://pricing.snapeda.com/search/part/10103592-0001LF/?ref=eda
JP1 = pinhead:PINHD-1X11: PIN HEADER
JP2 = pinhead:PINHD-1X16: PIN HEADER
L1 = CougsInSpace-Coils:INDUCTOR-H: Inductor Horizontal; CURRENT: 1.8A; DCR: 100mΩ; PACKAGE: 6060; SKU: 34-103A
LOGO1 = CougsInSpace-Aesthetics:SIGNATURE: Designer's (Artist's) Signature
Q1 Q2 = CougsInSpace-DiscreteSemi:MOSFET-N: N-Channel MOSFET; CURRENT: 19A; RDS: 5.9mΩ; SKU: 56-0001; VDS: 25V
Q3-Q5 = CougsInSpace-DiscreteSemi:MOSFET_DUAL_COM_D-N: N-Channel MOSFET - Dual Common Drain; CURRENT: 11.5A; RDS: 6.4mΩ; SKU: 56-0005; VDS: 20V
Q6 Q7 = BC817:BC817: Transistor, Npn, 0.5a, 45v, Sot23 Check availability <https://pricing.snapeda.com/parts/BC817/Rectron/view-part?ref=eda>; AVAILABILITY: In Stock; DESCRIPTION: Bipolar (BJT) Transistor NPN 45V 500mA 100MHz 250mW Surface Mount TO-236AB; MF: Rectron; MP: BC817; PACKAGE: SOT-23-3 Rectron; PRICE: None; PURCHASE-URL: https://pricing.snapeda.com/search/part/BC817/?ref=eda
Q8 = CougsInSpace-DiscreteSemi:MOSFET-N: N-Channel MOSFET; CURRENT: 500mA; RDS: 4.5mΩ; SKU: 56-0003; VDS: 50V
R1 R2 R23 R24 R35-R40 R48 R49 = CougsInSpace-Resistors:RES-V: Resistor Vertical; PACKAGE: 1608; POWER: 1/8W; SKU: 21-1002; TEMP: 25ppm/°C
R3 = CougsInSpace-Resistors:RES-V: Resistor Vertical; PACKAGE: 1608; POWER: 1/10W; SKU: 21-10.0; TEMP: 200ppm/°C
R4 = CougsInSpace-Resistors:RES-V: Resistor Vertical; PACKAGE: 1608; POWER: 1/8W; SKU: 21-4702; TEMP: 25ppm/°C
R5 = CougsInSpace-Resistors:RES-V: Resistor Vertical; PACKAGE: 1608; POWER: 1/5W; SKU: 21-2002; TEMP: 50ppm/°C
R6 R10 R14 = CougsInSpace-Resistors:RES-V: Resistor Vertical; PACKAGE: 1608; POWER: 1/8W; SKU: 21-3300; TEMP: 50ppm/°C
R7 R8 R11 R12 R15 R16 = CougsInSpace-Resistors:RES-V: Resistor Vertical; PACKAGE: 1608; POWER: 1/10W; SKU: 21-4754; TEMP: 100ppm/°C
R9 R13 R17 = CougsInSpace-Resistors:RES-V: Resistor Vertical; PACKAGE: 1608; POWER: 1/10W; SKU: 21-2201; TEMP: 100ppm/°C
R18 R19 = CougsInSpace-Resistors:RES-H: Resistor Horizontal; PACKAGE: 1608; POWER: 1/5W; SKU: 21-0.05; TEMP: 75ppm/°C
R20 R21 R42 R43 = CougsInSpace-Resistors:RES-V: Resistor Vertical; PACKAGE: 1608; POWER: 1/10W; SKU: 21-0000; TEMP: 70°C Max 2A
R22 = CRGH2010J2R0:CRGH2010J2R0: Res Thick Film 2010 2 Ohm 5% 1W ±200ppm/°C Molded SMD SMD T/R Check availability <https://pricing.snapeda.com/parts/CRGH2010J2R0/TE%20Connectivity/view-part?ref=eda>; AVAILABILITY: In Stock; COMMENT: 1879499-8; DESCRIPTION: Res Thick Film 2010 2 Ohm 5% 1W ±200ppm/°C Molded SMD SMD T/R; EU_ROHS_COMPLIANCE: Compliant with Exemptions; MF: TE Connectivity; MP: CRGH2010J2R0; PACKAGE: 2010; PRICE: None; PURCHASE-URL: https://pricing.snapeda.com/search/part/CRGH2010J2R0/?ref=eda
R25 R28 R30 R32 = CougsInSpace-Resistors:RES-V: Resistor Vertical; PACKAGE: 1608; POWER: 1/10W; SKU: 21-4423; TEMP: 100ppm/°C
R26 R27 R29 R31 = CougsInSpace-Resistors:RES-V: Resistor Vertical; PACKAGE: 1608; POWER: 1/10W; SKU: 21-3302; TEMP: 100ppm/°C
R33 R34 = CougsInSpace-Resistors:RES-H: Resistor Horizontal; PACKAGE: 1608; POWER: 1/8W; SKU: 21-1002; TEMP: 25ppm/°C
R44 R45 = CougsInSpace-Resistors:RES-V: Resistor Vertical; PACKAGE: 1608; POWER: 1/10W; SKU: 21-7502; TEMP: 10ppm/°C
R46 R47 = CougsInSpace-Resistors:RES-V: Resistor Vertical; PACKAGE: 1608; POWER: 1/8W; SKU: 21-1003; TEMP: 25ppm/°C
RT1-RT3 = CougsInSpace-Resistors:THERMISTOR-V: Thermistor Vertical; B2585: 3960K 1%; PACKAGE: 1608; SKU: 26-0008
SW1-SW5 = CougsInSpace-Switches:SWITCH-DPDT: Double Pole Double Throw - DPDT 100DP1T1B1M2QE <https://github.com/CougsInSpace/Resources/blob/master/SupplierDocuments/E-Switch/T121009_DPDT.pdf>; SKU: 49-0003
SW6 = CougsInSpace-Switches:SWITCH-SPST-NO: Single Pole Single Throw (SPST) B3U-1000P <https://github.com/CougsInSpace/Resources/blob/master/SupplierDocuments/OMRON/TactileSwitch_SMD.pdf>; SKU: 49-0005
TP1-5.0V TP2-CHARGER TP3-TS TP4-BATT_A TP5-BATT_B TP6-BATT_C TP7-TEMP_A TP8-TEMP_B TP9-TEMP_C TP10-USB_5.0V TP11-CP2102N_VDD TP12-3.3V TP13-GND TP14-D1_OUT = CougsInSpace-Connectors:TEST_POINT: Test Point Used to probe points in a circuit for debugging or general measurement
U1 = CougsInSpace-IC-Power:BQ24650: BQ24650 Solar Battery Charger BQ24650 <https://github.com/CougsInSpace/Resources/blob/master/SupplierDocuments/Ti/SolarBatteryCharger_BQ24650.pdf>; SKU: 60-0008
U2-U4 = CougsInSpace-IC-Power:BQ297*: Li-Ion Battery Protection BQ297xx <https://github.com/CougsInSpace/Resources/blob/master/SupplierDocuments/Ti/BQ2970.pdf>; OCC: -0.1V; OCCDELAY: 8ms; OCD: 0.1V; OCDDELAY: 20ms; OVP: 4.275V; OVPDELAY: 1.25s; SCD: 0.5V; SCDDELAY: 250µs; SKU: 60-0006; UVP: 2.8V; UVPDELAY: 144ms
U5 = CP2102N-A02-GQFN28:CP2102N-A02-GQFN28: Check availability <https://pricing.snapeda.com/parts/CP2102N-A02-GQFN28/Silicon%20Labs/view-part?ref=eda>; AVAILABILITY: In Stock; DESCRIPTION: USB Bridge, USB to UART USB 2.0 UART Interface 28-QFN (5x5); MF: Silicon Labs; MP: CP2102N-A02-GQFN28; PACKAGE: WFQFN-28 Silicon Labs; PRICE: None; PURCHASE-URL: https://pricing.snapeda.com/search/part/CP2102N-A02-GQFN28/?ref=eda
U7 = ESP32-S2-MINI-1:ESP32-S2-MINI-1: WiFi 802.11b/g/n Transceiver Module 2.412GHz - 2.484GHz Antenna Not Included Surface Mount Check availability <https://pricing.snapeda.com/parts/ESP32-S2-MINI-1/Espressif%20Systems/view-part?ref=eda>; AVAILABILITY: In Stock; DESCRIPTION: WiFi 802.11b/g/n Transceiver Module 2.412GHz ~ 2.484GHz Antenna Not Included Surface Mount; MF: Espressif Systems; MP: ESP32-S2-MINI-1; PACKAGE: NON STANDARD-65 Espressif Systems; PRICE: None; PURCHASE-URL: https://pricing.snapeda.com/search/part/ESP32-S2-MINI-1/?ref=eda
U$1 = LD1117AS33:LD1117AS33: Check availability <https://pricing.snapeda.com/parts/LD1117AS33/STMicroelectronics/view-part?ref=eda>; AVAILABILITY: In Stock; DESCRIPTION: Linear Voltage Regulator IC Positive Fixed 1 Output 1A SOT-223; MF: STMicroelectronics; MP: LD1117AS33; PACKAGE: SOT-223 STMicroelectronics; PRICE: None; PURCHASE-URL: https://pricing.snapeda.com/search/part/LD1117AS33/?ref=eda